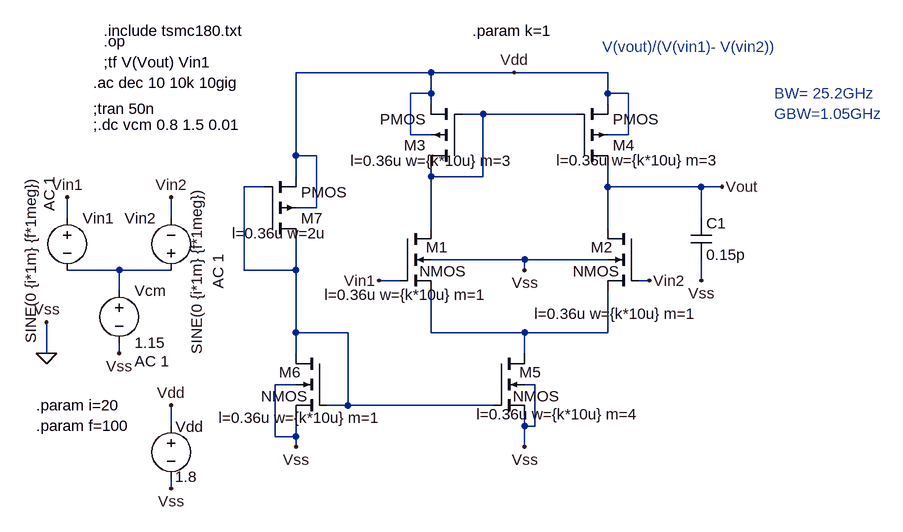
[diagram p0: schematic Wideband opamp-1GBW.asc]
Wideband opamp-1GBW.asc, the LTspice schematic file:
Version 4
SHEET 1 1328 680
WIRE 624 -64 416 -64
WIRE 752 -64 624 -64
WIRE 896 -64 752 -64
WIRE 624 -32 624 -64
WIRE 624 -32 592 -32
WIRE 896 -32 896 -64
WIRE 928 -32 896 -32
WIRE 624 -16 624 -32
WIRE 896 -16 896 -32
WIRE 704 0 672 0
WIRE 848 0 704 0
WIRE 592 32 592 -32
WIRE 624 32 592 32
WIRE 928 32 928 -32
WIRE 928 32 896 32
WIRE 416 64 416 -64
WIRE 448 64 416 64
WIRE 416 96 416 64
WIRE 624 96 624 80
WIRE 704 96 704 0
WIRE 704 96 624 96
WIRE 368 112 336 112
WIRE 896 112 896 80
WIRE 1040 112 896 112
WIRE 1072 112 1040 112
WIRE 448 144 448 64
WIRE 448 144 416 144
WIRE 64 160 64 128
WIRE 224 160 224 128
WIRE 1040 160 1040 112
WIRE 624 176 624 96
WIRE 896 176 896 112
WIRE 768 224 624 224
WIRE 896 224 768 224
WIRE 144 240 64 240
WIRE 224 240 144 240
WIRE 336 240 336 112
WIRE 416 240 416 192
WIRE 416 240 336 240
WIRE 768 240 768 224
WIRE 576 256 544 256
WIRE 960 256 944 256
WIRE 1040 256 1040 224
WIRE 144 272 144 240
WIRE 416 336 416 240
WIRE 496 336 416 336
WIRE 624 336 624 272
WIRE 768 336 624 336
WIRE 896 336 896 272
WIRE 896 336 768 336
WIRE 32 368 32 320
WIRE 144 368 144 352
WIRE 416 368 416 336
WIRE 768 368 768 336
WIRE 416 416 384 416
WIRE 784 416 768 416
WIRE 496 448 496 336
WIRE 496 448 464 448
WIRE 720 448 496 448
WIRE 224 480 224 448
WIRE 768 480 768 464
WIRE 784 480 784 416
WIRE 784 480 768 480
WIRE 384 496 384 416
WIRE 416 496 416 464
WIRE 416 496 384 496
WIRE 416 512 416 496
WIRE 768 512 768 480
WIRE 224 576 224 560
FLAG 32 368 0
FLAG 32 320 Vss
FLAG 224 576 Vss
FLAG 144 368 Vss
FLAG 224 448 Vdd
FLAG 544 256 Vin1
FLAG 752 -64 Vdd
FLAG 960 256 Vin2
FLAG 768 240 Vss
FLAG 64 128 Vin1
FLAG 224 128 Vin2
FLAG 1040 256 Vss
FLAG 1072 112 Vout
FLAG 768 512 Vss
FLAG 416 512 Vss
SYMBOL nmos4 576 176 R0
WINDOW 0 40 29 Left 2
WINDOW 3 30 66 Left 2
WINDOW 123 135 102 Right 2
SYMATTR InstName M1
SYMATTR Value2 l=0.36u w={k*10u} m=1
SYMBOL voltage 224 464 R0
WINDOW 123 0 0 Left 0
WINDOW 39 0 0 Left 0
WINDOW 0 7 17 Left 2
WINDOW 3 6 94 Left 2
SYMATTR InstName Vdd
SYMATTR Value 1.8
SYMBOL nmos4 944 176 M0
WINDOW 0 40 29 Left 2
WINDOW 3 30 66 Left 2
WINDOW 123 -90 131 Left 2
SYMATTR InstName M2
SYMATTR Value2 l=0.36u w={k*10u} m=1
SYMBOL voltage 144 256 R0
WINDOW 123 24 124 Left 2
WINDOW 39 0 0 Left 0
SYMATTR Value2 AC 1
SYMATTR InstName Vcm
SYMATTR Value 1.15
SYMBOL voltage 64 144 R0
WINDOW 3 -56 -48 VRight 2
WINDOW 123 -28 -48 VRight 2
WINDOW 39 0 0 Left 0
SYMATTR Value SINE(0 {i*1m} {f*1meg})
SYMATTR Value2 AC 1
SYMATTR InstName Vin1
SYMBOL voltage 224 256 R180
WINDOW 0 24 96 Left 2
WINDOW 3 -39 -114 VRight 2
WINDOW 123 -72 -13 VRight 2
WINDOW 39 0 0 Left 0
SYMATTR InstName Vin2
SYMATTR Value SINE(0 {i*1m} {f*1meg})
SYMATTR Value2 AC 1
SYMBOL pmos4 672 80 R180
WINDOW 123 -79 8 Left 2
SYMATTR Value2 l=0.36u w={k*10u} m=3
SYMATTR InstName M3
SYMBOL pmos4 848 80 M180
WINDOW 123 -31 9 Left 2
SYMATTR Value2 l=0.36u w={k*10u} m=3
SYMATTR InstName M4
SYMBOL cap 1024 160 R0
SYMATTR InstName C1
SYMATTR Value 0.15p
SYMBOL nmos4 720 368 R0
WINDOW 0 40 29 Left 2
WINDOW 3 30 66 Left 2
WINDOW 123 225 94 Right 2
SYMATTR InstName M5
SYMATTR Value2 l=0.36u w={k*10u} m=4
SYMBOL nmos4 464 368 M0
WINDOW 0 40 29 Left 2
WINDOW 3 30 66 Left 2
WINDOW 123 167 99 Right 2
SYMATTR InstName M6
SYMATTR Value2 l=0.36u w={k*10u} m=1
SYMBOL pmos4 368 192 M180
WINDOW 123 -50 9 Left 2
SYMATTR Value2 l=0.36u w=2u
SYMATTR InstName M7
TEXT 120 -128 Left 2 !.include tsmc180.txt
TEXT 120 -112 Left 2 !.op
TEXT 120 -80 Left 2 !;tf V(Vout) Vin1
TEXT 104 -48 Left 2 !.ac dec 10 10k 10gig
TEXT 104 -8 Left 2 !;tran 50n
TEXT 688 -128 Left 2 !.param k=1
TEXT 16 448 Left 2 !.param i=20\n.param f=100
TEXT 888 -104 Left 2 ;V(vout)/(V(vin1)- V(vin2))
TEXT 104 16 Left 2 !;.dc vcm 0.8 1.5 0.01
TEXT 1152 -32 Left 2 ;BW= 25.2GHz\nGBW=1.05GHz

The netlist it stands for:
* Wideband opamp-1GBW.asc
M1 N001 Vin1 N004 0 NMOS l=0.36u w={k*10u} m=1
Vdd Vdd 0 1.8
M2 Vout Vin2 N004 0 NMOS l=0.36u w={k*10u} m=1
Vcm N003 0 1.15 AC 1
Vin1 Vin1 N003 SINE(0 {i*1m} {f*1meg}) AC 1
Vin2 N003 Vin2 SINE(0 {i*1m} {f*1meg}) AC 1
M3 N001 N001 Vdd Vdd PMOS l=0.36u w={k*10u} m=3
M4 Vout N001 Vdd Vdd PMOS l=0.36u w={k*10u} m=3
C1 Vout 0 0.15p
M5 N004 N002 0 0 NMOS l=0.36u w={k*10u} m=4
M6 N002 N002 0 0 NMOS l=0.36u w={k*10u} m=1
M7 N002 N002 Vdd Vdd PMOS l=0.36u w=2u
.model NMOS NMOS
.model PMOS PMOS
.lib standard.mos
.include tsmc180.txt
.op
;tf V(Vout) Vin1
.ac dec 10 10k 10gig
;tran 50n
.param k=1
.param i=20
.param f=100
* V(vout)/(V(vin1)- V(vin2))
;.dc vcm 0.8 1.5 0.01
* BW= 25.2GHz
* GBW=1.05GHz
.backanno
.end